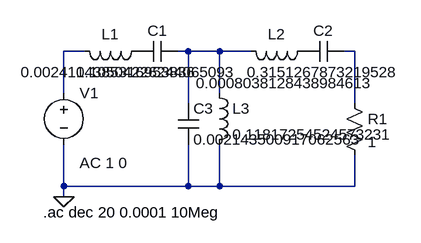
[diagram p0: schematic p3_5_butter_bpf_theor_1R.asc]
p3_5_butter_bpf_theor_1R.asc, the LTspice schematic file:
Version 4
SHEET 1 880 680
WIRE 48 80 16 80
WIRE 208 80 192 80
WIRE 256 80 208 80
WIRE 304 80 256 80
WIRE 464 80 448 80
WIRE 16 144 16 80
WIRE 256 144 256 80
WIRE 208 160 208 80
WIRE 464 160 464 80
WIRE 16 288 16 224
WIRE 208 288 208 224
WIRE 208 288 16 288
WIRE 256 288 256 224
WIRE 256 288 208 288
WIRE 464 288 464 240
WIRE 464 288 256 288
WIRE 16 304 16 288
FLAG 16 304 0
SYMBOL voltage 16 128 R0
WINDOW 123 24 124 Left 2
WINDOW 39 0 0 Left 2
SYMATTR Value2 AC 1 0
SYMATTR InstName V1
SYMATTR Value ""
SYMBOL res 448 144 R0
SYMATTR InstName R1
SYMATTR Value 1
SYMBOL cap 192 64 R90
WINDOW 0 0 32 VBottom 2
WINDOW 3 32 32 VTop 2
SYMATTR InstName C1
SYMATTR Value 0.10504226244065093
SYMBOL cap 448 64 R90
WINDOW 0 0 32 VBottom 2
WINDOW 3 32 32 VTop 2
SYMATTR InstName C2
SYMATTR Value 0.3151267873219528
SYMBOL ind 240 128 R0
SYMATTR InstName L3
SYMATTR Value 0.11817254524573231
SYMBOL ind 144 64 R90
WINDOW 0 5 56 VBottom 2
WINDOW 3 32 56 VTop 2
SYMATTR InstName L1
SYMATTR Value 0.0024114385316953836
SYMBOL ind 400 64 R90
WINDOW 0 5 56 VBottom 2
WINDOW 3 49 42 VTop 2
SYMATTR InstName L2
SYMATTR Value 0.0008038128438984613
SYMBOL cap 192 160 R0
SYMATTR InstName C3
SYMATTR Value 0.002143500917062563
TEXT -16 328 Left 2 !.ac dec 20 0.0001 10Meg

The netlist it stands for:
* p3_5_butter_bpf_theor_1R.asc
V1 N001 0 AC 1 0
R1 N003 0 1
C1 N002 P001 0.10504226244065093
C2 N003 P002 0.3151267873219528
L3 N002 0 0.11817254524573231
L1 P001 N001 0.0024114385316953836
L2 P002 N002 0.0008038128438984613
C3 N002 0 0.002143500917062563
.ac dec 20 0.0001 10Meg
.backanno
.end